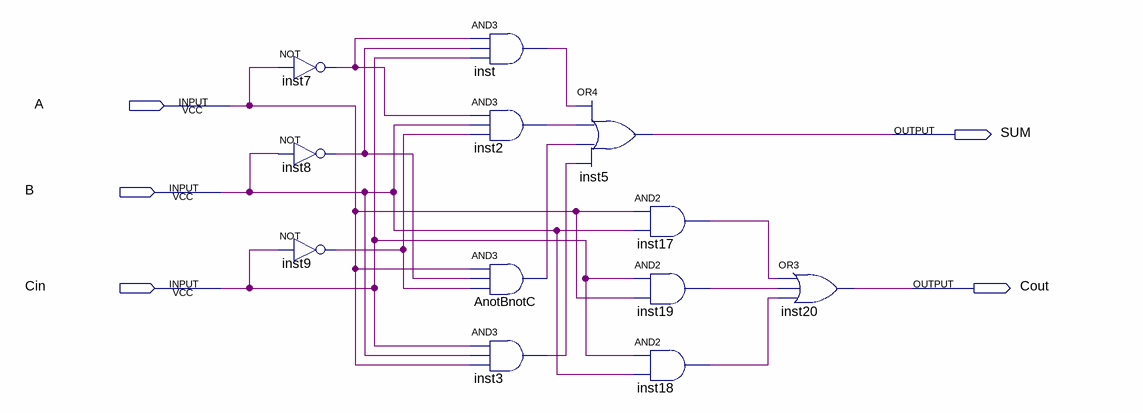
[diagram p0: schematic sheet]
// Quartus schematic FullAdder.bdf as structural Verilog: 12 symbols, 5 pins
module FullAdder (
  input  A,
  input  B,
  input  Cin,
  output SUM,
  output Cout
);

  wire AnotBnotC_out, inst2_out, inst3_out, inst7_out, inst8_out, inst9_out, inst17_out, inst18_out,
       inst19_out, inst_out;

  not inst7 (inst7_out, A);
  not inst8 (inst8_out, B);
  not inst9 (inst9_out, Cin);
  and inst (inst_out, inst7_out, inst8_out, Cin);
  and inst2 (inst2_out, inst7_out, B, inst9_out);
  and AnotBnotC (AnotBnotC_out, A, inst8_out, inst9_out);
  and inst3 (inst3_out, Cin, B, A);
  or inst5 (SUM, inst_out, inst2_out, AnotBnotC_out, inst3_out);
  and inst17 (inst17_out, A, B);
  and inst19 (inst19_out, Cin, A);
  and inst18 (inst18_out, Cin, B);
  or inst20 (Cout, inst17_out, inst19_out, inst18_out);
endmodule
